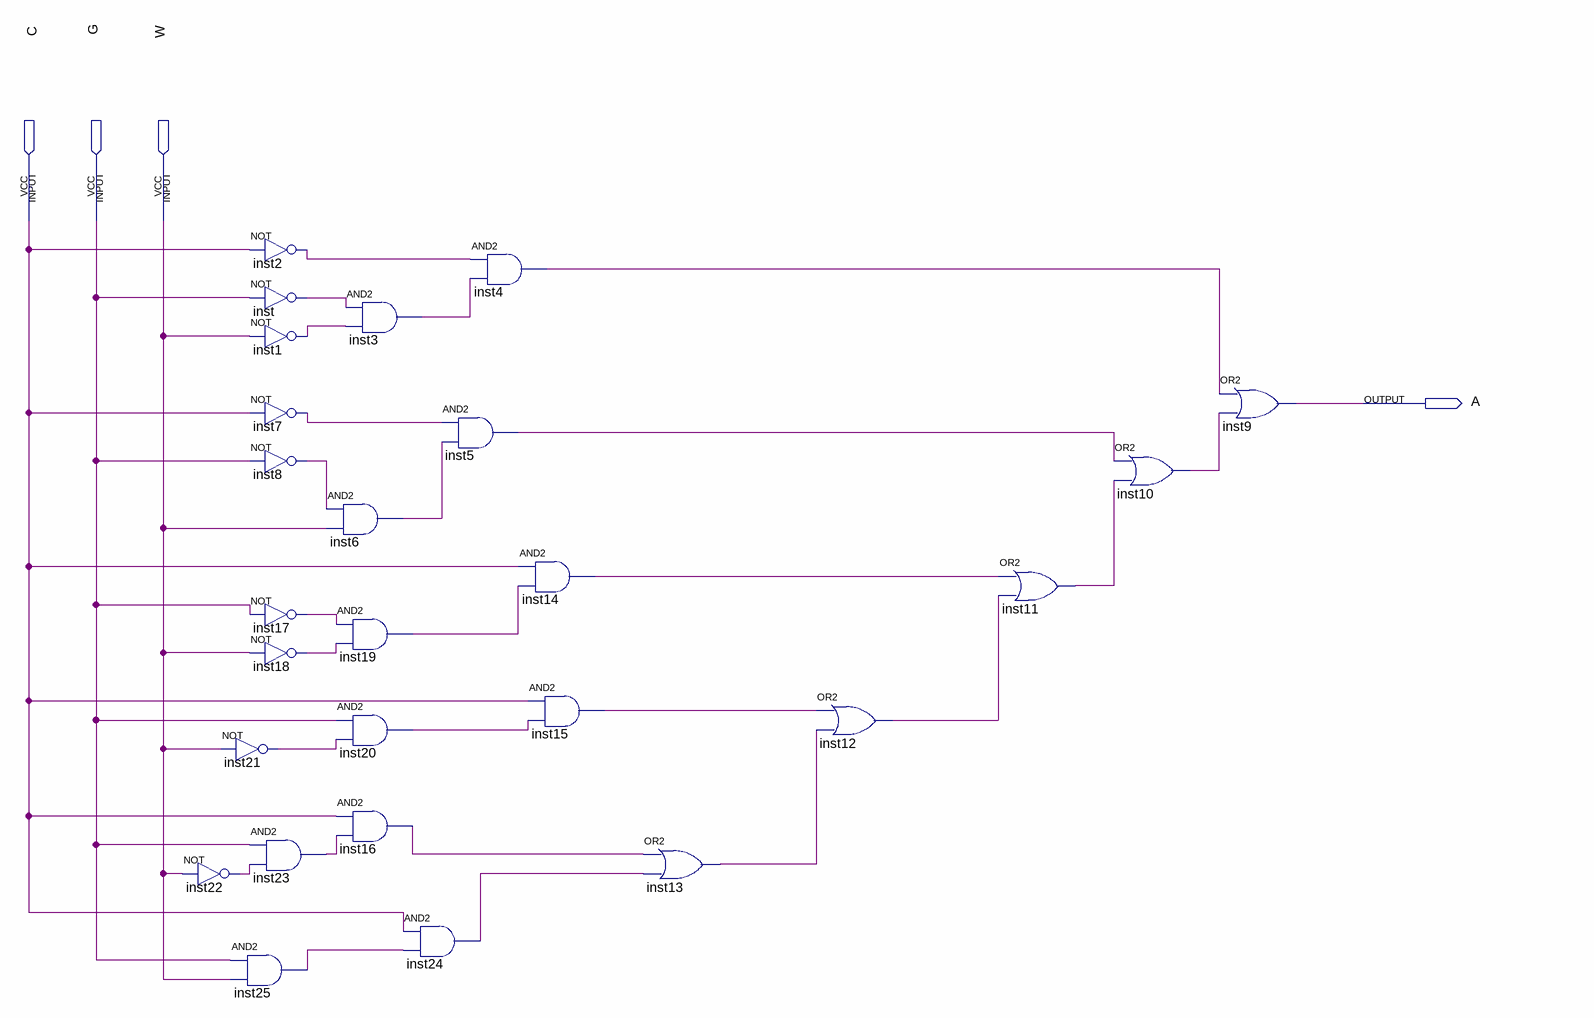
[diagram p0: schematic sheet]
// Quartus schematic lab2step2.bdf as structural Verilog: 26 symbols, 4 pins
module lab2step2 (
  input  C,
  input  G,
  input  W,
  output A
);

  wire inst1_out, inst2_out, inst3_out, inst4_out, inst5_out, inst6_out, inst7_out, inst8_out, inst10_out,
       inst11_out, inst12_out, inst13_out, inst14_out, inst15_out, inst16_out, inst17_out, inst18_out,
       inst19_out, inst20_out, inst21_out, inst22_out, inst23_out, inst24_out, inst25_out, inst_out;

  not inst22 (inst22_out, W);
  not inst2 (inst2_out, C);
  not inst (inst_out, G);
  not inst1 (inst1_out, W);
  not inst7 (inst7_out, C);
  not inst8 (inst8_out, G);
  not inst17 (inst17_out, G);
  not inst18 (inst18_out, W);
  not inst21 (inst21_out, W);
  and inst23 (inst23_out, G, inst22_out);
  and inst25 (inst25_out, G, W);
  and inst3 (inst3_out, inst_out, inst1_out);
  and inst6 (inst6_out, inst8_out, W);
  and inst19 (inst19_out, inst17_out, inst18_out);
  and inst20 (inst20_out, G, inst21_out);
  and inst16 (inst16_out, C, inst23_out);
  and inst24 (inst24_out, C, inst25_out);
  and inst4 (inst4_out, inst2_out, inst3_out);
  and inst5 (inst5_out, inst7_out, inst6_out);
  and inst14 (inst14_out, C, inst19_out);
  and inst15 (inst15_out, C, inst20_out);
  or inst13 (inst13_out, inst16_out, inst24_out);
  or inst12 (inst12_out, inst15_out, inst13_out);
  or inst11 (inst11_out, inst14_out, inst12_out);
  or inst10 (inst10_out, inst5_out, inst11_out);
  or inst9 (A, inst4_out, inst10_out);
endmodule
